# EAGLE design CndyShield (EAGLE 9.6.0)
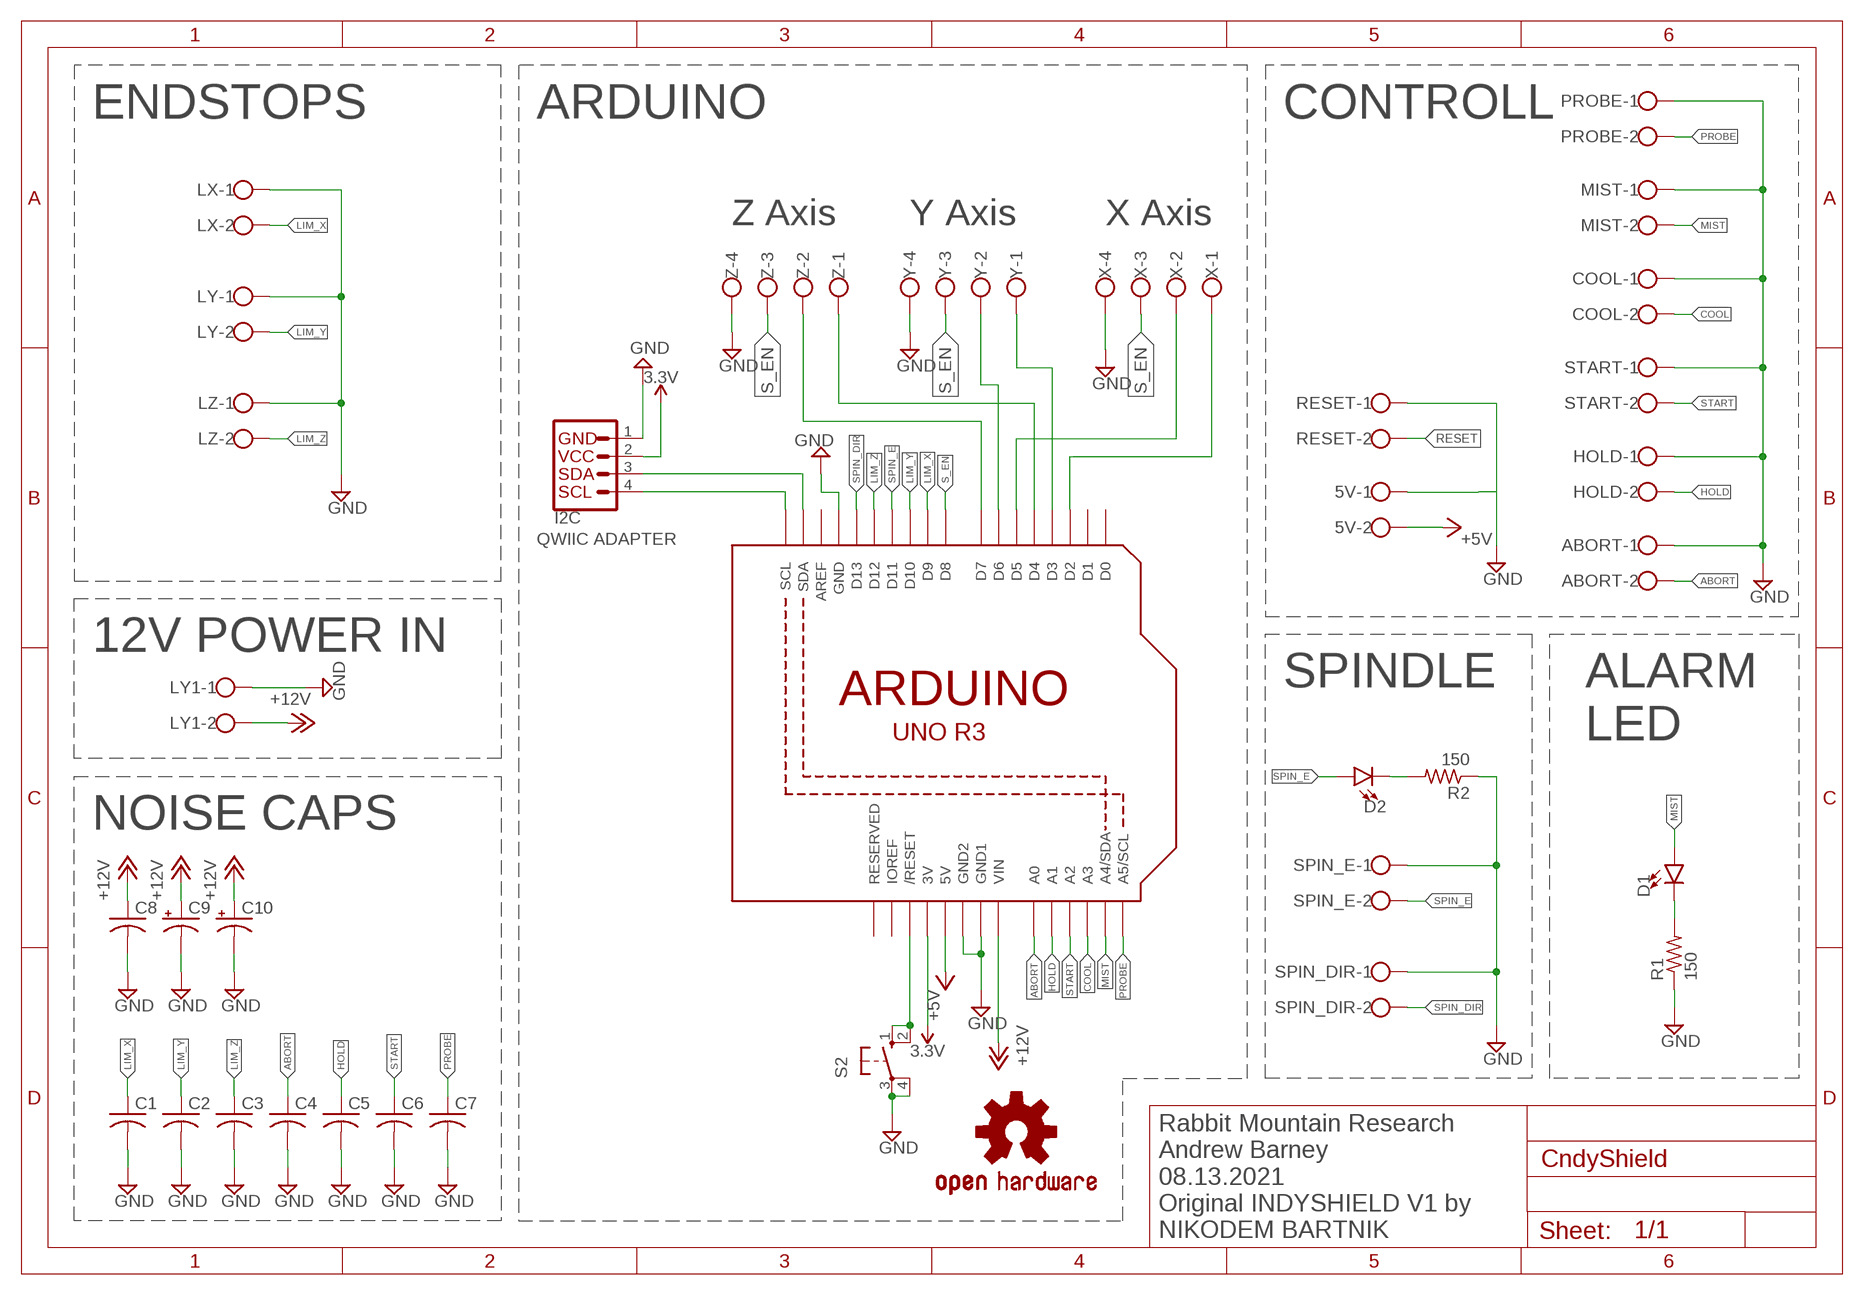
[diagram p0: schematic, sheet 1]

## Parts
5V  W237-102  [W237-102]
ABORT  W237-102  [W237-102]
C1  C-US025-024X044  [C025-024X044]
C2  C-US025-024X044  [C025-024X044]
C3  C-US025-024X044  [C025-024X044]
C4  C-US025-024X044  [C025-024X044]
C5  C-US025-024X044  [C025-024X044]
C6  C-US025-024X044  [C025-024X044]
C7  C-US025-024X044  [C025-024X044]
C8  C-US025-024X044  [C025-024X044]
C9  CPOL-USE1.8-4  [E1,8-4]
C10  CPOL-USE1.8-4  [E1,8-4]
COOL  W237-102  [W237-102]
D1  LED5MM  [LED_5MM]
D2  LED5MM  [LED_5MM]
HOLD  W237-102  [W237-102]
I2C  I2C_STANDARD  [1X04]
LOGO1  OSHW-LOGOM  [OSHW-LOGO-M]
LX  W237-102  [W237-102]
LY  W237-102  [W237-102]
LY1  W237-102  [W237-102]
LZ  W237-102  [W237-102]
MIST  W237-102  [W237-102]
PROBE  W237-102  [W237-102]
R1  150  R-US_0207/10  [0207/10]
R2  150  R-US_0207/10  [0207/10]
RESET  W237-102  [W237-102]
S2  10-XX  [B3F-10XX]
SPIN_DIR  W237-102  [W237-102]
SPIN_E  W237-102  [W237-102]
START  W237-102  [W237-102]
U1  ARDUINOR3-BPLACE  [ARDUINOR3-BPLACE]
X  W237-4  [W237-4]
Y  W237-4  [W237-4]
Z  W237-4  [W237-4]

## Nets
3.3V: I2C.2 U1.3V
+5V: 5V.2 U1.5V
+12V: C8.1 C9.+ C10.+ LY1.2 U1.VIN
ABORT: ABORT.2 C4.1 U1.A0
COOL: COOL.2 U1.A3
GND: 5V.1 ABORT.1 C1.2 C2.2 C3.2 C4.2 C5.2 C6.2 C7.2 C8.2 C9.- C10.- COOL.1 HOLD.1 I2C.1 LX.1 LY1.1 LY.1 LZ.1 MIST.1 PROBE.1 R1.1 R2.1 RESET.1 S2.3(P) S2.4(P1) SPIN_DIR.1 SPIN_E.1 START.1 U1.GND U1.GND1 U1.GND2 X.4 Y.4 Z.4
HOLD: C5.1 HOLD.2 U1.A1
LIM_X: C1.1 LX.2 U1.D9
LIM_Y: C2.1 LY.2 U1.D10
LIM_Z: C3.1 LZ.2 U1.D12
MIST: D1.A MIST.2 U1.A4(A4/SDA)
N$1: U1.D5 X.2
N$2: U1.D2 X.1
N$3: U1.D6 Y.2
N$4: U1.D3 Y.1
N$5: U1.D7 Z.2
N$6: U1.D4 Z.1
N$8: D1.K(C) R1.2
N$9: I2C.3 U1.SDA
N$10: I2C.4 U1.SCL
N$11: D2.K(C) R2.2
PROBE: C7.1 PROBE.2 U1.A5(A5/SCL)
RESET: RESET.2 S2.1(S) S2.2(S1) U1.RESET(/RESET)
S_EN: U1.D8 X.3 Y.3 Z.3
SPIN_DIR: SPIN_DIR.2 U1.D13
SPIN_E: D2.A SPIN_E.2 U1.D11
START: C6.1 START.2 U1.A2
Unconnected: U1.AREF U1.D0 U1.D1 U1.IOREF U1.RESERVED

## Notes on the sheet
- ENDSTOPS | ARDUINO | CONTROLL
- Z Axis | Y Axis | X Axis
- QWIIC ADAPTER
- 12V POWER IN
- SPINDLE
- ALARM
  LED
- NOISE CAPS
- Rabbit Mountain Research
  Andrew Barney
  08.13.2021
- Original INDYSHIELD V1 by 
  NIKODEM BARTNIK

## Library data of the parts
5V ABORT COOL HOLD LX LY LY1 LZ MIST PROBE RESET SPIN_DIR SPIN_E START = con-wago-500:W237-102: WAGO SCREW CLAMP; MPN: 237-102; OC_FARNELL: unknown; OC_NEWARK: 70K9898
C1-C8 = adafruit:C-US: CAPACITOR, American symbol
C9 C10 = adafruit:CPOL-US: POLARIZED CAPACITOR, American symbol
D1 D2 = SparkFun-LED:LED: LED (Generic) Standard schematic elements and footprints for 5mm, 3mm, 1206, and 0603 sized LEDs. Generic LEDs with no color specified.
I2C = SparkFun-Connectors:I2C_STANDARD: SparkFun I2C Standard Pinout Header SparkFun has standardized on a pinout for all I2C based sensor breakouts. This pinout allows I2C boards to be plugged directly into the headers on Arduino Uno compatible boards, and to be daisy chained easily. Example SparkFun Products: SparkFun Atmospheric Sensor Breakout - BME280 <https://www.sparkfun.com/products/13676> SparkFun Altitude/Pressure Sensor Breakout - MPL3115A2 <https://www.sparkfun.com/products/11084> SparkFun TOF Range Finder Sensor - VL6180 <https://www.sparkfun.com/products/12785>
LOGO1 = RMR:OSHW-LOGO: Open-Source Hardware (OSHW) Logo This logo indicates the piece of hardware it is found on incorporates a OSHW license and/or adheres to the definition of open source hardware found here: http://freedomdefined.org/OSHW
R1 R2 = adafruit:R-US_: RESISTOR, American symbol
S2 = switch-omron:10-XX: OMRON SWITCH; MPN: B3F-1000; OC_FARNELL: 176432; OC_NEWARK: 36M3542
U1 = adafruit:ARDUINOR3: This is a new object for the new Arduino R3 - with extra pins that you may want to use (such as IOref, and duplicated A4/A5
X Y Z = con-wago-500:W237-4: WAGO SCREW CLAMP; OC_FARNELL: unknown; OC_NEWARK: unknown

## Net classes
1 supply: width 0.33 mm, clearance 0.254 mm

## Board
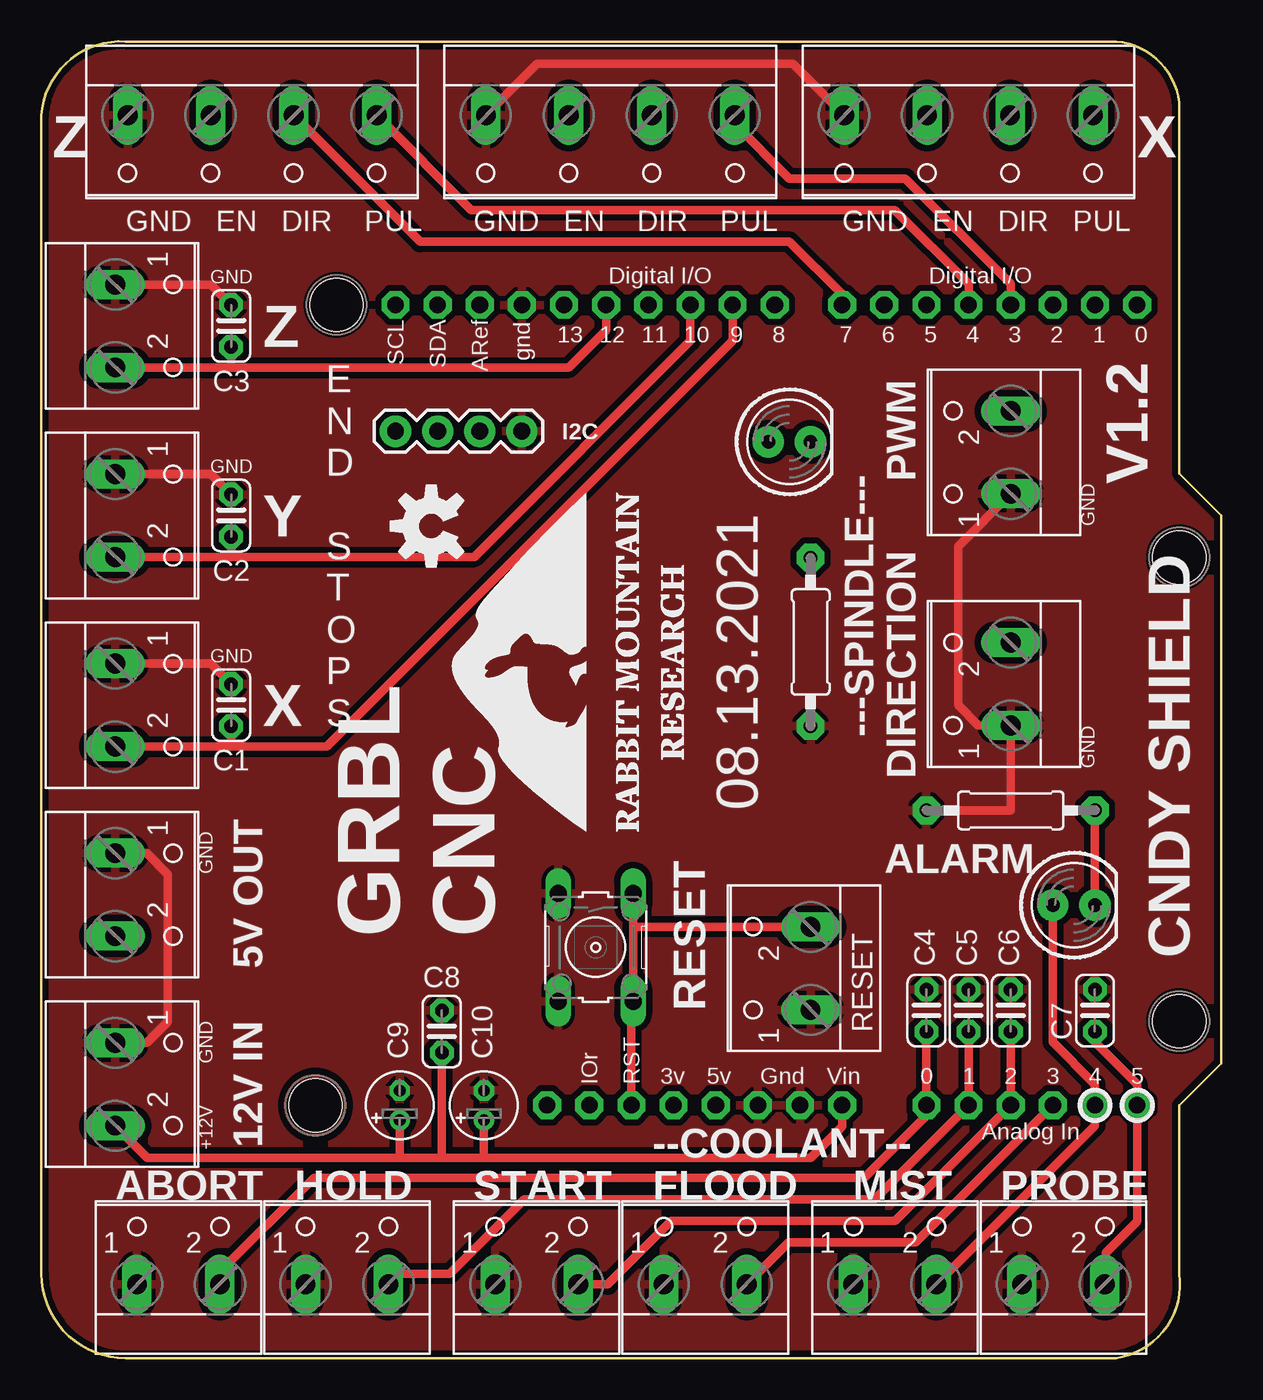
[diagram p1: board, top side]
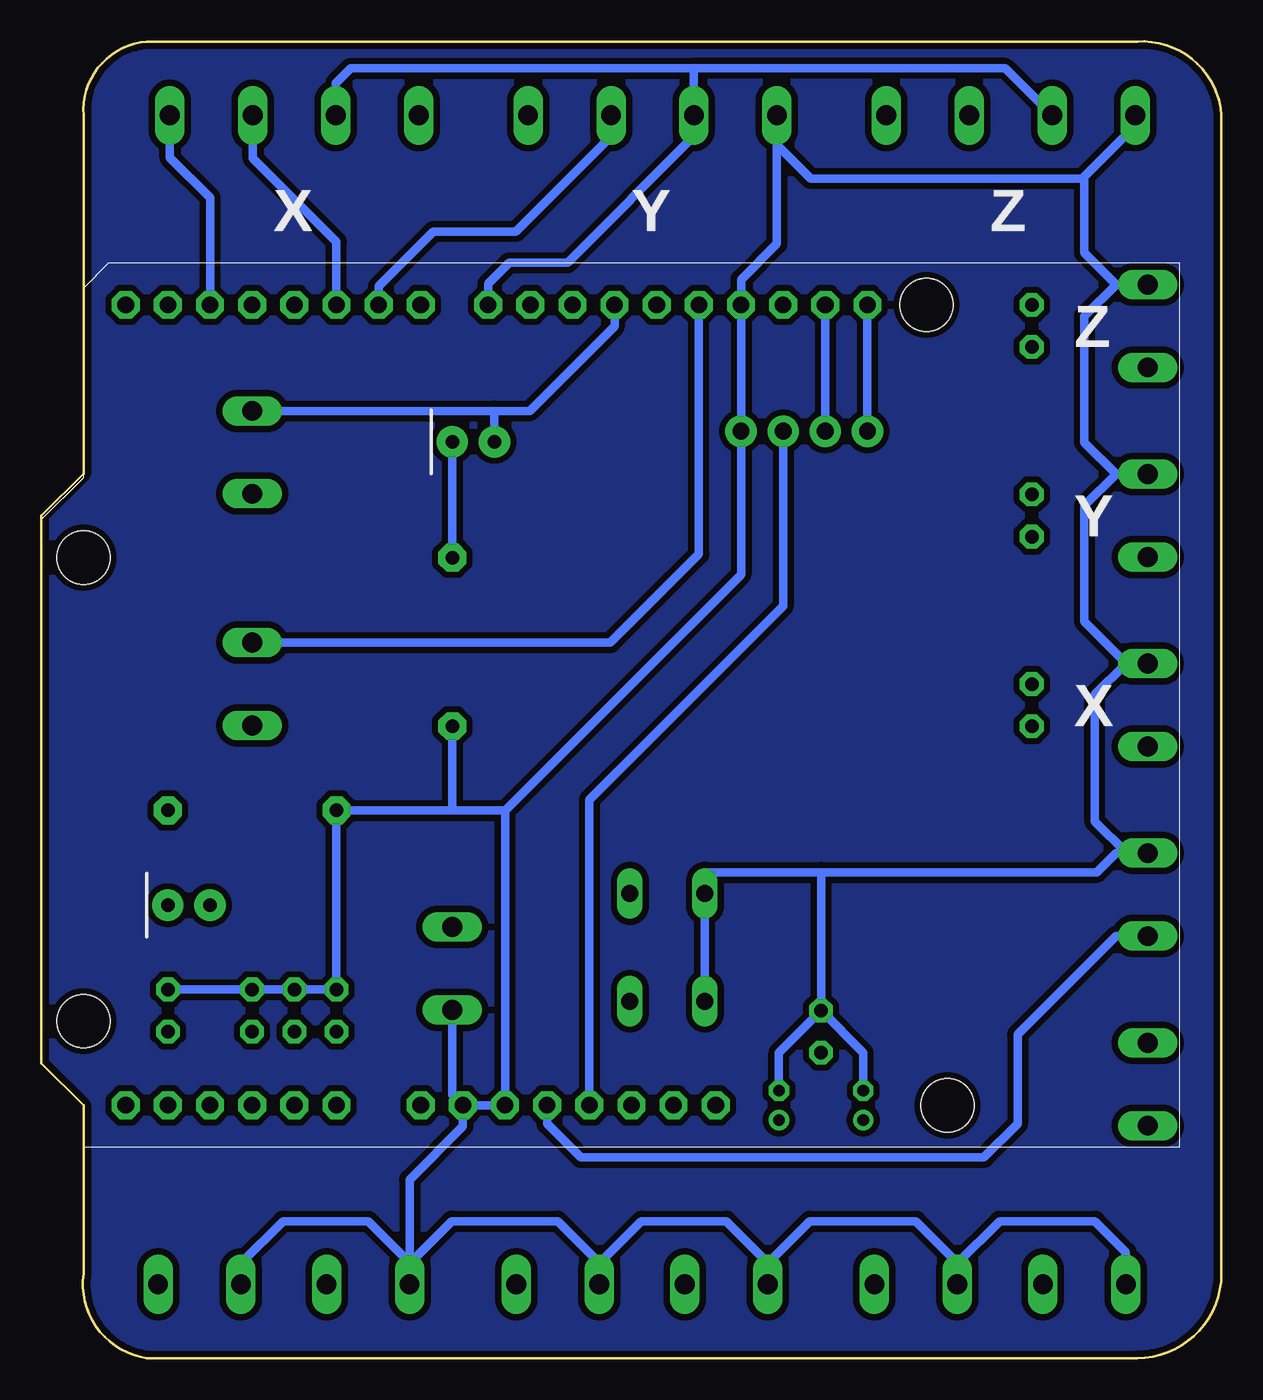
[diagram p2: board, bottom side, seen from below]

Size 71.12 x 79.38 mm. Coordinates in mm from the lower left corner, seen from the top.
Outline: 0,5.08 0,74.93 arc-90 5.08,79.38 64.77,79.38 arc-90 68.58,74.93 68.58,53.34 71.12,50.8 71.12,17.78 68.58,15.24 68.58,5.08 arc-90 64.77,0 5.08,0 arc-90 0,5.08
Copper layers (1*16): Top 0.035mm / dielectric 1.5mm / Bottom 0.035mm
Design rules "default *": minimum track width 6mil, minimum drill 0.35mm, track to track 15mil, track to pad 8mil, pad to pad 8mil, via to via 8mil, smd to smd 8mil, copper to edge 15mil, drill to drill 8mil, minimum pad ring 10mil, minimum via ring 8mil, stop-mask expansion 4mil, vias tented up to drill 0mil, thermal gap 10mil
Holes 3.2 mm at 17.78,63.5 16.51,15.24 68.58,20.32 68.58,48.26

### Footprints (pad centres in the part's own frame; a part is rotated, then mirrored left to right if it is on the bottom)
W237-102 = drill 1.194 long: 1 -2.5,-1.27; 2 2.5,-1.27
C025-024X044 = drill 0.813 pad 1.422 octagon: 1 -1.27,0; 2 1.27,0
E1,8-4 = drill 0.711 pad 1.168: + -0.889,0 | drill 0.711 pad 1.168 octagon: - 0.889,0
LED_5MM = drill 0.813 pad 1.88: A -1.27,0; K 1.27,0
1X04 = drill 1.016 pad 1.88: 1 0,0; 2 2.54,0; 3 5.08,0; 4 7.62,0
0207/10 = drill 0.813 pad 1.676 octagon: 1 -5.08,0; 2 5.08,0
B3F-10XX = drill 1.016 long: 1 -3.251,2.261; 2 3.251,2.261; 3 -3.251,-2.261; 4 3.251,-2.261
ARDUINOR3-BPLACE = drill 1 pad 1.676 octagon: 3V 35.56,2.54; 5V 38.1,2.54; A0 50.8,2.54; A1 53.34,2.54; A2 55.88,2.54; A3 58.42,2.54; A4 60.96,2.54; A5 63.5,2.54; AREF 23.876,50.8; D0 63.5,50.8; D1 60.96,50.8; D2 58.42,50.8; D3 55.88,50.8; D4 53.34,50.8; D5 50.8,50.8; D6 48.26,50.8; D7 45.72,50.8; D8 41.656,50.8; D9 39.116,50.8; D10 36.576,50.8; D11 34.036,50.8; D12 31.496,50.8; D13 28.956,50.8; GND 26.416,50.8; GND1 43.18,2.54; GND2 40.64,2.54; IOREF 30.48,2.54; RESERVED 27.94,2.54; RESET 33.02,2.54; SCL 18.796,50.8; SDA 21.336,50.8; VIN 45.72,2.54
W237-4 = drill 1.194 long: 1 -7.5,-1.27; 2 -2.5,-1.27; 3 2.5,-1.27; 4 7.5,-1.27

### Placement (x,y rotation side)
5V  5.71,27.94 270 top
ABORT  8.26,5.71 0 top
C1  11.43,39.37 90 top
C2  11.43,50.8 90 top
C3  11.43,62.23 90 top
C4  53.34,20.95 90 top
C5  55.88,20.95 90 top
C6  58.42,20.95 90 top
C7  63.5,20.95 90 top
C8  24.13,19.68 90 top
C9  21.59,15.24 90 top
C10  26.67,15.24 90 top
COOL  40.01,5.71 0 top
D1  62.23,27.3 0 top
D2  45.09,55.25 0 top
HOLD  18.41,5.71 0 top
I2C  28.96,55.88 180 top
LOGO1  23.5,50.17 90 top
LX  5.71,39.37 270 top
LY  5.71,50.8 270 top
LY1  5.71,16.51 270 top
LZ  5.71,62.23 270 top
MIST  51.44,5.71 0 top
PROBE  61.59,5.71 0 top
R1  58.42,33.02 0 top
R2  46.36,43.18 90 top
RESET  45.09,23.5 90 top
S2  33.4,24.77 270 top
SPIN_DIR  57.15,40.64 90 top
SPIN_E  57.15,54.61 90 top
START  29.85,5.71 0 top
U1  2.54,12.7 0 top
U$2  [RMR-SIT-14MM]  38.73,31.75 90 top
X  55.88,73.66 180 top
Y  34.29,73.66 180 top
Z  12.7,73.66 180 top

### Tracks (layer width: path | path; a pad name or v marks a point on that pad's centre or on a via)
3.3V
  Bottom 0.508: I2C.2 26.42,45.34 38.1,33.66 U1.3V
+5V
  Bottom 0.508: U1.5V 40.64,14.12 38.62,12.09 14.32,12.09 12.29,14.12 12.29,19.5 6.35,25.44 5V.2
+12V
  Top 0.508: U1.VIN 48.26,13.97 46.36,12.06 26.67,12.06 | 26.67,12.06 24.13,12.06 | 24.13,12.06 21.59,12.06 | 21.59,12.06 6.39,12.06 LY1.2 | C9.+ 21.59,12.06 | C10.+ 26.67,12.06 | C8.1 24.13,12.06
ABORT
  Top 0.508: ABORT.2 10.76,5.2 16.43,10.87 49.61,10.87 53.34,14.61 U1.A0 C4.1
COOL
  Top 0.508: COOL.2 45.05,6.98 52.7,6.98 U1.A3
GND
  Top 0.508: Y.4 29.89,78.03 45.28,78.03 X.4 | LY1.1 6.35,19.01 7.62,20.28 7.62,29.17 6.35,30.44 5V.1 | SPIN_E.1 55.24,48.94 55.24,39.37 56.48,38.14 SPIN_DIR.1 58.42,33.02 R1.1 | C3.2 10.2,64.73 LZ.1 | C2.2 10.2,53.3 LY.1 | C1.2 10.2,41.87 LX.1
  Bottom 0.508: 5V.1 4.49,30.48 | 6.35,64.73 8.26,66.64 8.26,71.24 | Z.4 5.2,74.3 8.26,71.24 | 8.26,71.24 8.38,71.12 24.77,71.12 26.79,73.15 Y.4 26.79,67.19 28.96,65.02 U1.GND I2C.1 28.96,47.24 43.18,33.02 | LZ.1 6.35,64.73 | 6.35,64.73 8.26,62.83 8.26,55.21 6.35,53.3 | 6.35,53.3 8.26,51.4 8.26,44.41 5.74,41.89 | LY.1 6.35,53.3 | 5.74,41.89 5.71,41.87 LX.1 | 5V.1 5.71,30.44 7.62,32.35 7.62,40.01 5.74,41.89 | 24.13,29.29 31.12,29.29 31.14,29.26 S2.3 31.12,28.02 31.14,27.99 S2.4 | 24.13,29.29 7.5,29.29 6.35,30.44 5V.1 | PROBE.1 59.09,5.71 56.55,8.25 51.44,8.25 48.94,5.75 MIST.1 | MIST.1 48.94,5.71 46.4,8.25 40.01,8.25 37.51,5.75 COOL.1 37.51,5.71 34.97,8.25 29.85,8.25 27.35,5.75 START.1 27.35,5.71 24.8,8.25 18.41,8.25 15.91,5.75 HOLD.1 15.91,5.71 13.38,8.25 7.62,8.25 5.75,6.39 ABORT.1 | U1.GND1 U1.GND2 43.18,33.02 | U1.GND1 45.72,13.97 48.94,10.75 MIST.1 | C7.2 C6.2 C5.2 C4.2 R1.1 46.36,33.02 | C8.2 24.13,29.29 | C9.- 21.59,18.41 C8.2 | C10.- 26.67,18.41 C8.2 | U1.GND1 46.36,15.88 RESET.1 | 46.36,33.02 43.18,33.02 | R2.1 46.36,33.02
  pour Top (isolate 0.305): 0,2.54 0,76.84 2.54,79.38 66.67,79.38 68.58,77.47 68.58,53.34 71.12,50.8 71.12,17.78 68.58,15.24 68.58,1.91 66.67,0 2.54,0
HOLD
  Top 0.508: 20.71,5.08 24.61,5.08 29.1,9.58 50.22,9.58 U1.A1 C5.1 | 20.71,5.08 20.32,5.08 | HOLD.2 20.71,4.65 20.71,5.08
LIM_X
  Top 0.508: LX.2 11.43,36.87 | 11.43,36.87 17.19,36.87 41.66,61.34 U1.D9 | C1.1 11.43,36.87
LIM_Y
  Top 0.508: LY.2 11.43,48.3 | 11.43,48.3 26.07,48.3 39.12,61.34 U1.D10 | C2.1 11.43,48.3
LIM_Z
  Top 0.508: LZ.2 11.43,59.73 | 11.43,59.73 31.79,59.73 34.04,61.98 U1.D12 | C3.1 11.43,59.73
MIST
  Top 0.508: D1.A 60.96,19.05 63.5,16.51 U1.A4 63.5,14.01 MIST.2
N$1
  Bottom 0.508: U1.D5 53.34,67.31 58.38,72.35 X.2
N$2
  Bottom 0.508: U1.D2 60.96,69.97 63.38,72.39 X.1
N$3
  Bottom 0.508: Y.2 36.79,73.66 42.53,67.92 47.51,67.92 50.8,64.62 U1.D6
N$4
  Top 0.508: U1.D3 58.42,64.77 52.07,71.12 45.09,71.12 41.79,74.42 Y.1
N$5
  Top 0.508: U1.D7 48.26,64.14 45.09,67.31 22.82,67.31 Z.2
N$6
  Top 0.508: U1.D4 55.88,64.77 51.44,69.22 25.91,69.22 Z.1
N$8
  Top 0.508: D1.K R1.2
N$9
  Bottom 0.508: U1.SDA I2C.3
N$10
  Bottom 0.508: U1.SCL I2C.4
N$11
  Bottom 0.508: D2.K R2.2
PROBE
  Top 0.508: PROBE.2 64.13,4.48 64.13,6.35 66.04,8.25 U1.A5 66.04,16.51 63.5,19.05 C7.1
RESET
  Top 0.508: U1.RESET 35.56,21.41 S2.2 35.66,26.04 | 35.66,26.04 S2.1 | RESET.2 35.7,26 35.66,26.04
S_EN
  Bottom 0.508: X.3 53.38,76.87 52.49,77.76 31.79,77.76 | Z.3 13.03,77.76 31.79,77.76 | 31.79,77.76 Y.3 31.79,73.66 39.41,66.04 42.93,66.04 44.2,64.77 U1.D8
SPIN_DIR
  Bottom 0.508: SPIN_DIR.2 36.83,43.14 31.5,48.47 U1.D13
SPIN_E
  Bottom 0.508: U1.D11 36.58,62.23 41.7,57.11 43.81,57.11 | SPIN_E.2 43.81,57.11 | D2.A 43.81,57.11
START
  Top 0.508: START.2 34.13,4.45 37.97,8.28 51.46,8.28 U1.A2 C6.1
VCC
  pour Bottom (isolate 0.305): 0,76.84 0,2.54 2.54,0 66.67,0 68.58,1.91 68.58,15.24 71.12,17.78 71.12,50.8 68.58,53.34 68.58,77.47 66.67,79.38 2.54,79.38
(copper drawn outside any net)
  shapes: Top circle x1

### Text on the board
tPlace: Z | X | Z | V1.2 | Y | X | ---SPINDLE--- | DIRECTION PWM | ALARM | GRBL / CNC | 5V OUT | CNDY SHIELD | RESET | 12V IN | --COOLANT-- | ABORT | HOLD | START | FLOOD | MIST | PROBE
bPlace: Z | Y | X | Z | Y | X
tNames: GND EN DIR PUL | GND EN DIR PUL | GND EN DIR PUL | GND | GND | GND | GND | E / N / D / / S / T / O / P / S | GND | 08.13.2021 | GND | GND | +12V
tTest: Based on the INDYSHIELD V1 by NIKODEM BARTNIK. / / V1.0: Fixed the swapped GRBL pins for Coolant and Z-axis End Stop. / Changed the I2C port to be compatible with Sparkfun's QWIIC adapter. / Added an arduino reset button. / / V1.1: Remapped analog breakouts & added alarm led on analog 4. / Added decoupling noise reduction capacitors for limit switches. / / V1.2: Fixed swapped silkscreen text for Spindle PWM and / Spindle Direction. Added LED to Spindle PWM (pin 11). / Added more noise reduction capacitors to input buttons. / Added optional breakout for Arduino reset. / Fixed 3.2mm mounting holes and unrouted air wires.